# Altium schematic sheet ctrl.SchDoc: Project SHED
size A4; DrawnBy: ultralyj; DocumentNumber: 2; Revision: 0.1; SheetNumber: 2; SheetTotal: 2
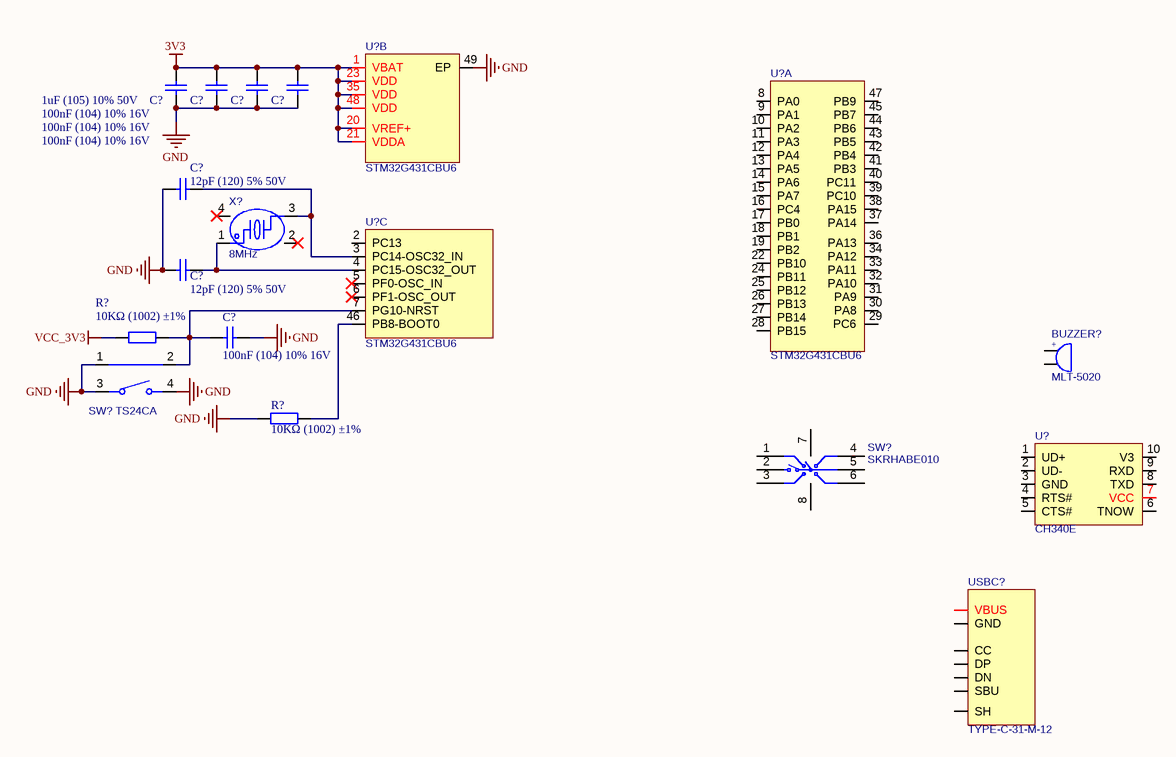
[diagram p0: ctrl.SchDoc]

## Parts
(Parts that share a designator on the sheet are numbered #1, #2 ... from top to bottom, then left to right.)
BUZZER?  MLT-5020  [BUZ-SMD_L5.0-W5.5-P4.60]
C?#1  1uF (105) 10% 50V  [0603_C]
C?#2  100nF (104) 10% 16V  [0402_C]
C?#3  100nF (104) 10% 16V  [0402_C]
C?#4  100nF (104) 10% 16V  [0402_C]
C?#5  12pF (120) 5% 50V  [0402_C]
C?#6  12pF (120) 5% 50V  [0402_C]
C?#7  100nF (104) 10% 16V  [LC-0402_C_NOSILK]
R?#1  10KΩ (1002) ±1%  [LC-0402_R_NOSILK]
R?#2  10KΩ (1002) ±1%  [LC-0402_R_NOSILK]
SW?#1  TS24CA  [SW-SMD_TS24CA]
SW?#2  SKRHABE010  [SW-SMD_SKRHABE010]
U?#1  STM32G431CBU6  [UFQFPN-48_L7.0-W7.0-P0.50-BL-EP]  (part B of 3)
U?#2  STM32G431CBU6  [UFQFPN-48_L7.0-W7.0-P0.50-BL-EP]  (part A of 3)
U?#3  STM32G431CBU6  [UFQFPN-48_L7.0-W7.0-P0.50-BL-EP]  (part C of 3)
U?#4  CH340E  [MSOP-10_L3.0-W3.0-P0.50-LS5.0-BL]
USBC?  TYPE-C-31-M-12  [USB-C_SMD-TYPE-C-31-M-12]
X?  8MHz  [CRYSTAL-SMD_4P-L3.2-W2.5-BL]

## Nets
3V3: C?#1.2 C?#2.2 C?#3.2 C?#4.2 U?#1.1(VBAT) U?#1.20(VREF+) U?#1.21(VDDA) U?#1.23(VDD) U?#1.35(VDD) U?#1.48(VDD)
GND: C?#1.1 C?#2.1 C?#3.1 C?#4.1 C?#5.1 C?#6.1 C?#7.2 R?#2.1 SW?#1.1 SW?#1.3 SW?#1.4 U?#1.49(EP)
VCC_3V3: R?#1.1
NetC?#5_2: C?#5.2 U?#3.3(PC14-OSC32_IN) X?.3
NetC?#6_2: C?#6.2 U?#3.4(PC15-OSC32_OUT) X?.1
NetC?#7_1: C?#7.1 R?#1.2 SW?#1.2 U?#3.7(PG10-NRST)
NetR?#2_2: R?#2.2 U?#3.46(PB8-BOOT0)

Not connected (* = marked no-connect by the designer): BUZZER? 1 2; SW?#2 1(A) 2(CEN) 3(C) 4(D) 5(COM) 6(B) 7 8; U?#2 8(PA0) 9(PA1) 10(PA2) 11(PA3) 12(PA4) 13(PA5) 14(PA6) 15(PA7) 16(PC4) 17(PB0) 18(PB1) 19(PB2) 22(PB10) 24(PB11) 25(PB12) 26(PB13) 27(PB14) 28(PB15) 29(PC6) 30(PA8) 31(PA9) 32(PA10) 33(PA11) 34(PA12) 36(PA13) 37(PA14) 38(PA15) 39(PC10) 40(PC11) 41(PB3) 42(PB4) 43(PB5) 44(PB6) 45(PB7) 47(PB9); U?#3 2(PC13) 5(PF0-OSC_IN)* 6(PF1-OSC_OUT)*; U?#4 1(UD+) 2(UD-) 3(GND) 4(RTS#) 5(CTS#) 6(TNOW) 7(VCC) 8(TXD) 9(RXD) 10(V3); USBC? 0,1,2,3(SH) A1,B1,A12,B12(GND) A4,A9,B4,B9(VBUS) A5,B5(CC) A6,B6(DP) A7,B7(DN) A8,B8(SBU); X? 2(GND)* 4(GND)*

## Notes on the sheet
- Title
- Size:
- A4
- Date:
- File:
- Document Number:
- Time:
- Revision:
- Designed by:
- (in symbol MLT-5020) +

## Library data of the parts
BUZZER? = MLT-5020: 薄款贴片无源蜂鸣器; BOM_Manufacturer: 华能; Frequency: 4000Hz; BOM_Supplier: LCSC; BOM_Manufacturer Part: MLT-5020; BOM_Supplier Part: C94598; BOM_JLCPCB Part Class: Extended Part; spicePre: B; spiceSymbolName: MLT-5020
C?#1 = 0603 1uF (105) 10% 50V: 贴片电容; ComponentLink1Description: 供应商链接; ComponentLink1URL: http://www.szlcsc.com/product/details_16531.html; Package: 0603; Supplier: LC; SuppliersPartNumber: C15849
C?#2-C?#4 C?#7 = 0402 100nF (104) 10% 16V: 贴片电容; ComponentLink1Description: 供应商链接; ComponentLink1URL: http://www.szlcsc.com/product/details_1877.html; Package: 0402; Supplier: LC; SuppliersPartNumber: C1525
C?#5 C?#6 = 0402 12pF (120) 5% 50V: 贴片电容; ComponentLink1Description: 供应商链接; ComponentLink1URL: http://www.szlcsc.com/product/details_1899.html; Package: 0402; Supplier: LC; SuppliersPartNumber: C1547
R?#1 R?#2 = 0402 10KΩ (1002) 1%: 贴片电阻; ComponentLink1Description: 供应商链接; ComponentLink1URL: http://www.szlcsc.com/product/details_26487.html; Package: 0402; Supplier: LC; SuppliersPartNumber: C25744
SW?#1 = TS24CA: 按键; BOM_Manufacturer: SHOU HAN(首韩); Contributor: LCSC; BOM_Supplier: LCSC; BOM_Supplier Part: C393942; BOM_Manufacturer Part: TS24CA; BOM_JLCPCB Part Class: Extended Part; spicePre: S; spiceSymbolName: TS24CA
SW?#2 = SKRHABE010: 五向开关; BOM_Manufacturer: ALPSALPINE(阿尔卑斯阿尔派); Contributor: LCSC; BOM_Supplier: LCSC; BOM_Manufacturer Part: SKRHABE010; BOM_Supplier Part: C139794; BOM_JLCPCB Part Class: Extended Part; spicePre: S; spiceSymbolName: SKRHABE010
U?#1-U?#3 = STM32G431CBU6: Cortex-M4 MCU; BOM_Manufacturer: ST(意法半导体); Contributor: LCSC; BOM_Supplier: LCSC; BOM_Supplier Part: C529356; BOM_Manufacturer Part: STM32G431CBU6; BOM_JLCPCB Part Class: Extended Part; spicePre: U; spiceSymbolName: STM32G431CBU6
U?#4 = CH340E: ttl-usb芯片; BOM_Manufacturer: WCH(南京沁恒); BOM_Supplier: LCSC; BOM_Manufacturer Part: CH340E; BOM_Supplier Part: C99652; BOM_JLCPCB Part Class: Extended Part; spicePre: U; spiceSymbolName: CH340E
USBC? = TYPE-C-31-M-12: 贴片type-c母座; BOM_Manufacturer: 韩国韩荣; Contributor: LCSC; BOM_Supplier: LCSC; BOM_Supplier Part: C165948; BOM_Manufacturer Part: TYPE-C-31-M-12; BOM_JLCPCB Part Class: Extended Part; spicePre: U; spiceSymbolName: TYPE-C-31-M-12
X? = 8MHz: 8MHz无源晶振（负载电容12pF）; BOM_Manufacturer: JWT(晶威特); BOM_Manufacturer Part: CF4008M00012T8188031; Contributor: LCSC; nameAlias: Frequency; BOM_Supplier: LCSC; BOM_Supplier Part: C2933033; spicePre: X; spiceSymbolName: CF4008M00012T8188031